# EasyEDA schematic SCH_Spotify-Display_2026-06-03.json
TITLE: Sheet_1; REV: 1.0; Date: 2026-05-27; Sheet: 1/1; Drawn By: mustafabios; Company: Your Company
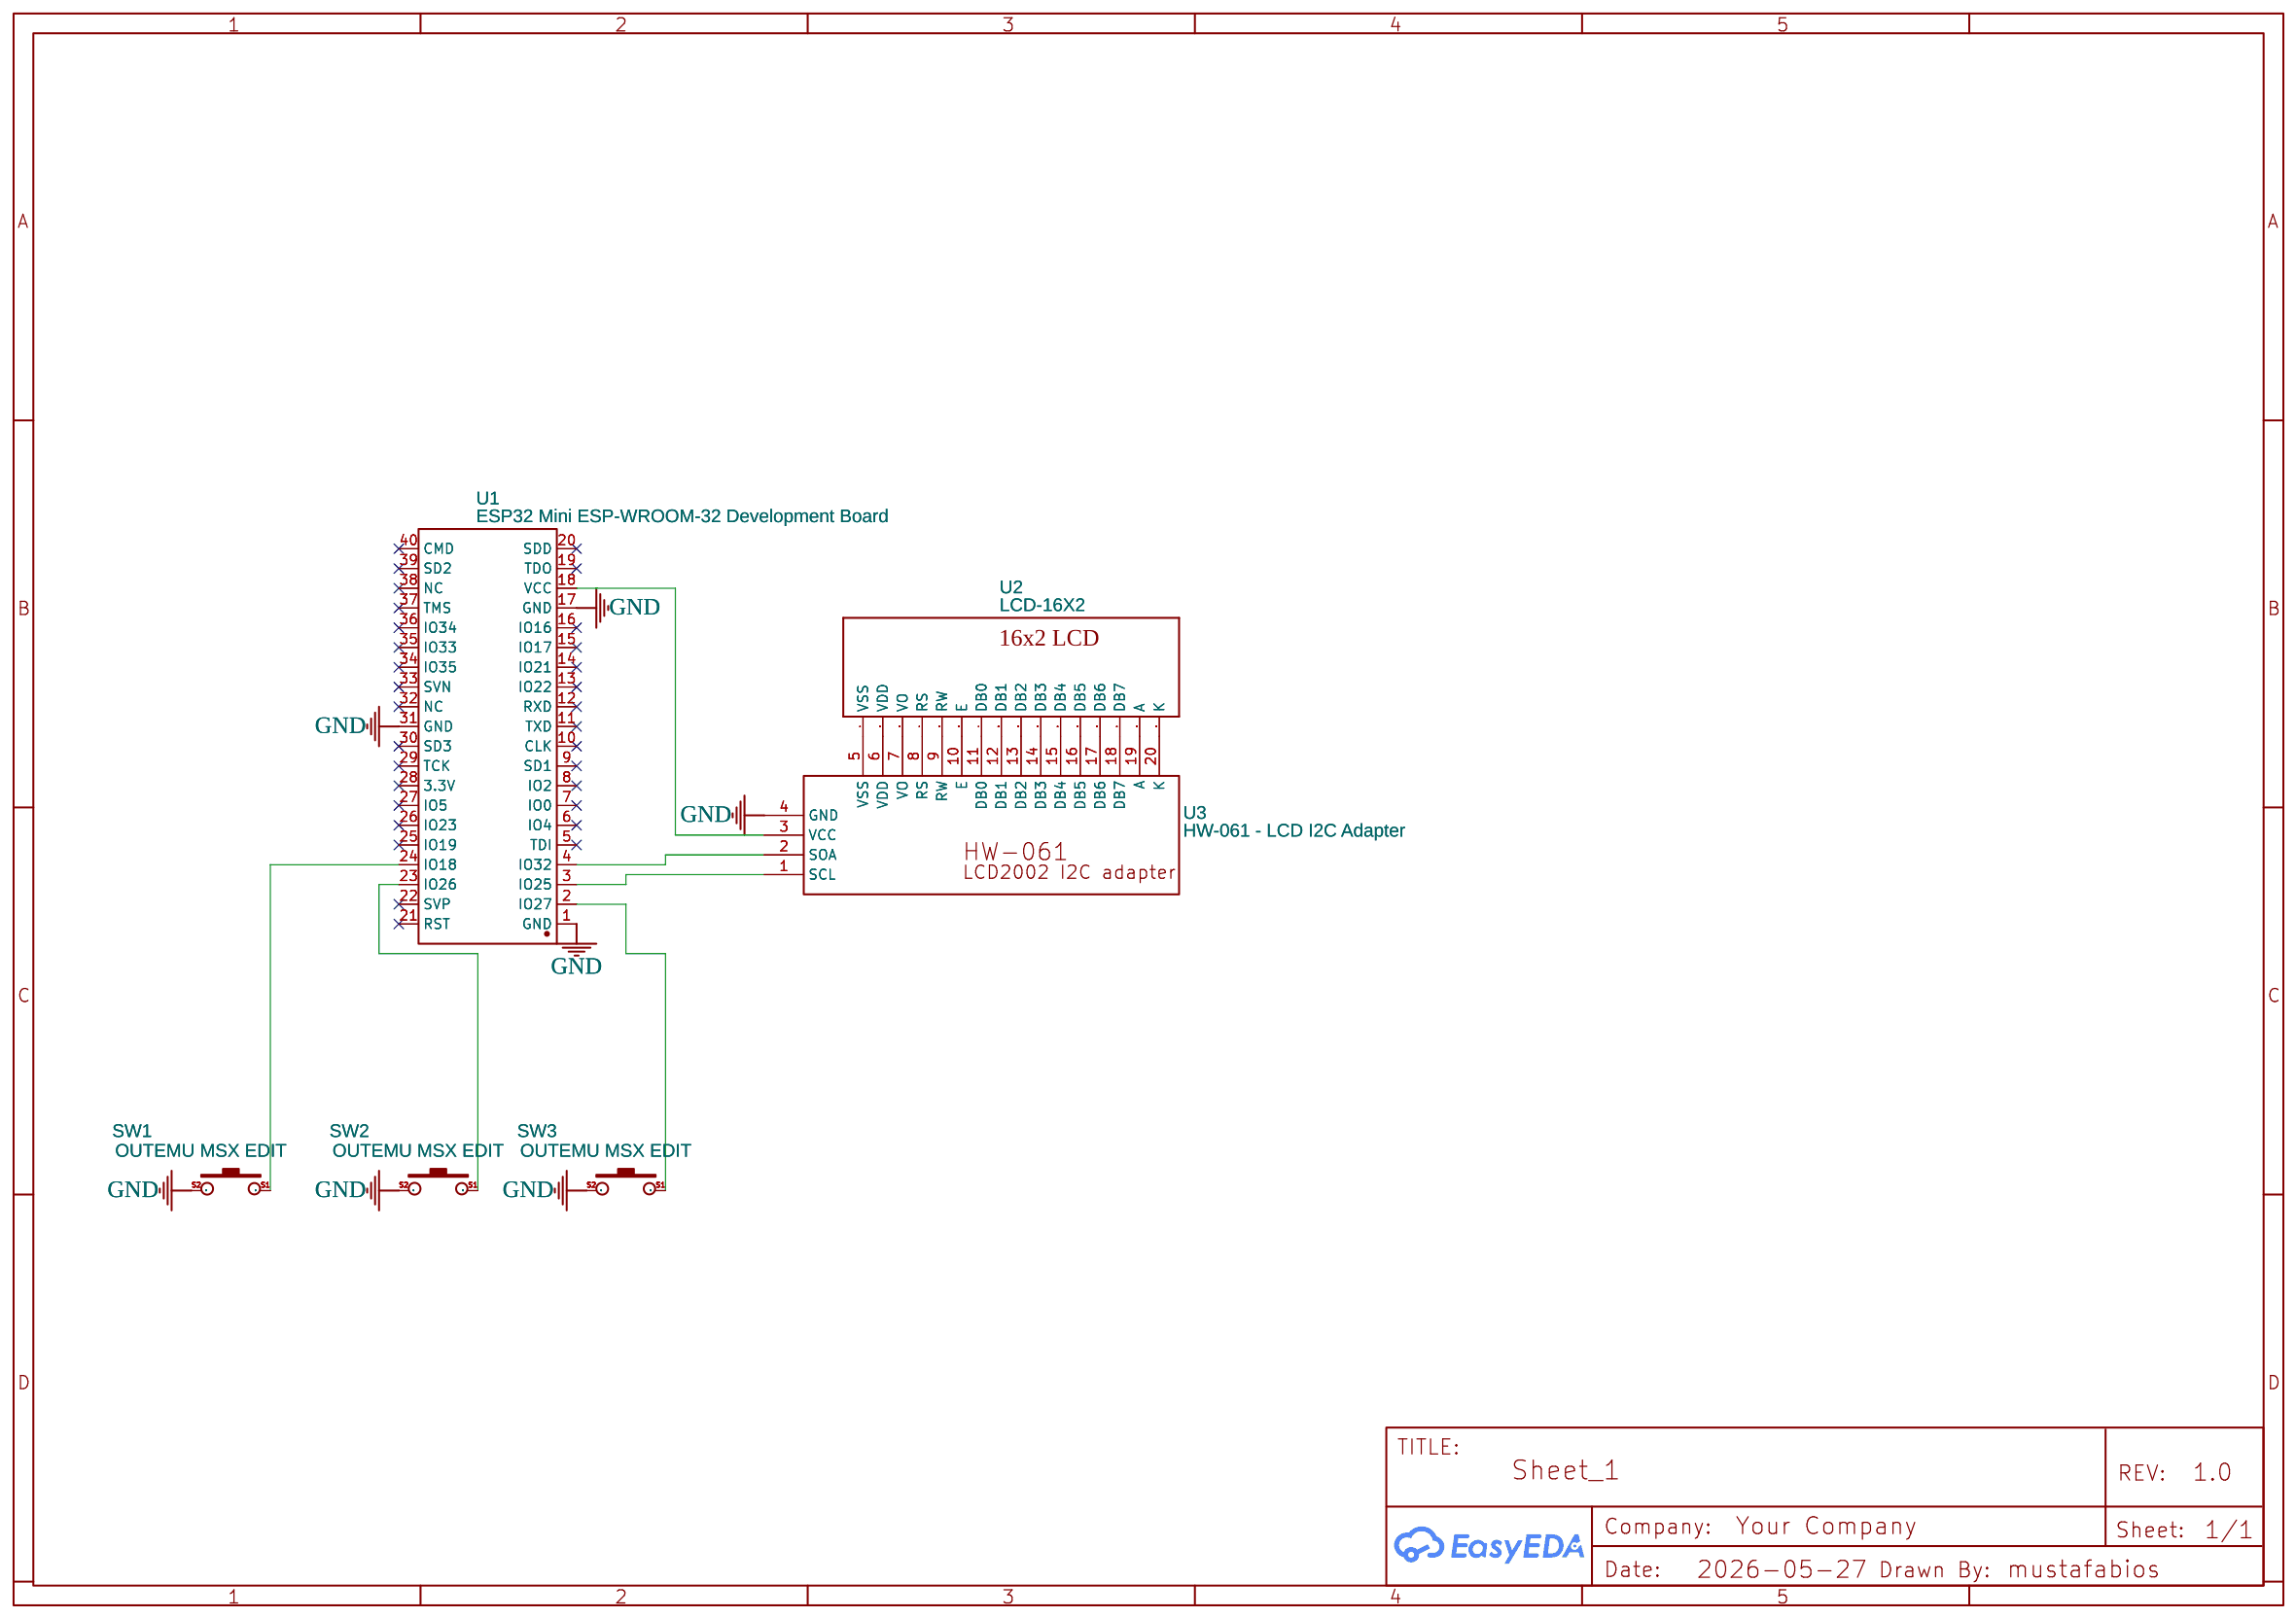
[diagram p0: schematic sheet]

## Parts
SW1  OUTEMU MSX EDIT  [OUTEMU MSX EDIT]
SW2  OUTEMU MSX EDIT  [OUTEMU MSX EDIT]
SW3  OUTEMU MSX EDIT  [OUTEMU MSX EDIT]
U1  ESP32 Mini ESP-WROOM-32 Development Board  [ESP32 MINI ESP-WROOM-32 DEVELOPMENT BOARD]
U2  LCD-16X2  [LCD-16X2]
U3  HW-061 - LCD I2C Adapter  [HW-061]

## Library data of the parts
SW1-SW3 = OUTEMU MSX EDIT: Contributor: Kenzef; Convert to PCB: Yes; Add into BOM: Yes
U1 = ESP32 Mini ESP-WROOM-32 Development Board: Manufacturer: HiLetgo; Manufacturer Part: B07BK435ZW; Supplier Part: 8541612412; Supplier: Amazon; Contributor: jackfulks1
U2 = LCD-16X2: Contributor: SparkFun
U3 = HW-061 - LCD I2C Adapter: Supplier: Banggood; Contributor: aminop

## Nets
GND: SW1.S2 SW2.S2 SW3.S2 U1.1(GND) U1.17(GND) U1.31(GND) U3.4(GND)
Net-(SW1-S1): SW1.S1 U1.24(IO18)
Net-(SW2-S1): SW2.S1 U1.23(IO26)
Net-(SW3-S1): SW3.S1 U1.2(IO27)
Net-(U1-3): U1.3(IO25) U3.1(SCL)
Net-(U1-4): U1.4(IO32) U3.2(SOA)
Net-(U1-18): U1.18(VCC) U3.3(VCC)
Net-(U2-1): U2.1(VSS) U3.5(VSS)
Net-(U2-2): U2.2(VDD) U3.6(VDD)
Net-(U2-3): U2.3(VO) U3.7(VO)
Net-(U2-4): U2.4(RS) U3.8(RS)
Net-(U2-5): U2.5(RW) U3.9(RW)
Net-(U2-6): U2.6(E) U3.10(E)
Net-(U2-7): U2.7(DB0) U3.11(DB0)
Net-(U2-8): U2.8(DB1) U3.12(DB1)
Net-(U2-9): U2.9(DB2) U3.13(DB2)
Net-(U2-10): U2.10(DB3) U3.14(DB3)
Net-(U2-11): U2.11(DB4) U3.15(DB4)
Net-(U2-12): U2.12(DB5) U3.16(DB5)
Net-(U2-13): U2.13(DB6) U3.17(DB6)
Net-(U2-14): U2.14(DB7) U3.18(DB7)
Net-(U2-15): U2.15(A) U3.19(A)
Net-(U2-16): U2.16(K) U3.20(K)

Not connected (* = marked no-connect by the designer): U1 5(TDI)* 6(IO4)* 7(IO0)* 8(IO2)* 9(SD1)* 10(CLK)* 11(TXD)* 12(RXD)* 13(IO22)* 14(IO21)* 15(IO17)* 16(IO16)* 19(TDO)* 20(SDD)* 21(RST)* 22(SVP)* 25(IO19)* 26(IO23)* 27(IO5)* 28(3.3V)* 29(TCK)* 30(SD3)* 32(NC)* 33(SVN)* 34(IO35)* 35(IO33)* 36(IO34)* 37(TMS)* 38(NC)* 39(SD2)* 40(CMD)*
